# Altium project Common_ASIC_tester.PrjPcb (part 1 of 2)
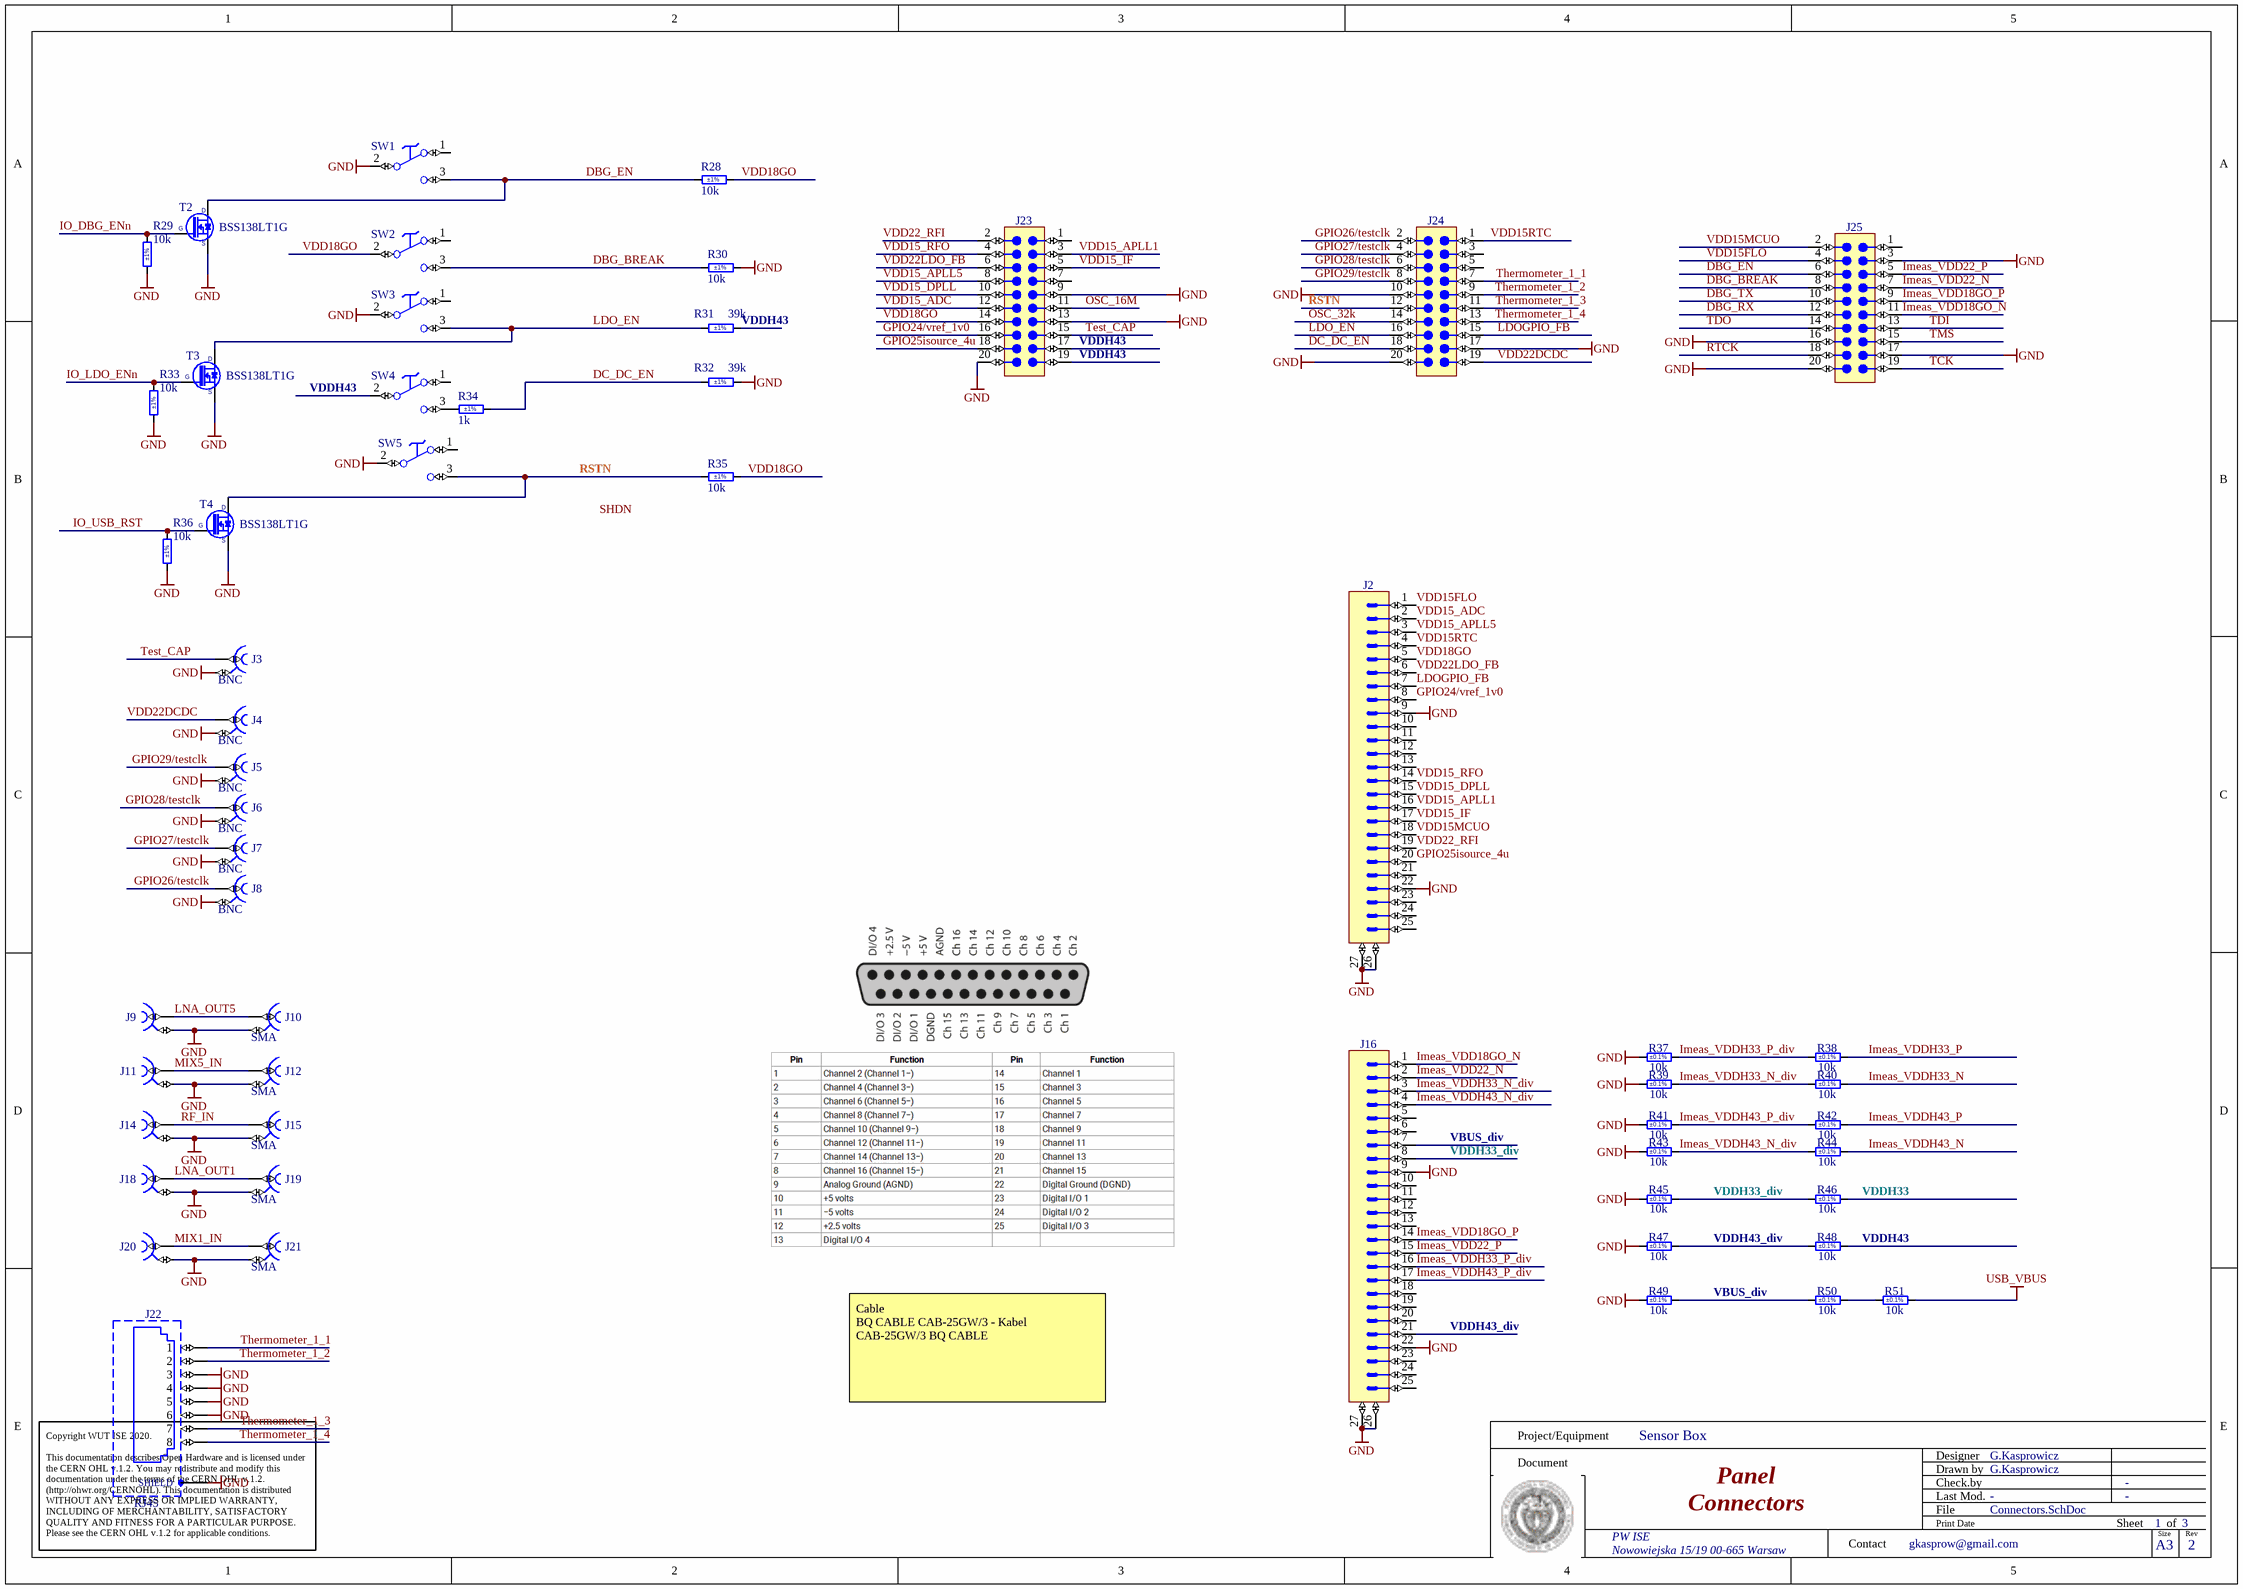
[diagram p0: Connectors.SchDoc]
4 sheets, 175 parts. Net scope: global (net labels, ports and power ports of the same name join across sheets).
Board file: Common_ASIC_tester.PcbDoc
Sheets:
  Connectors.SchDoc
  DIGITAL.SchDoc
  MAIN.SchDoc
  POWER.SchDoc

## Sheet Connectors.SchDoc: Panel
size 420 x 297 mm; Author: G.Kasprowicz; CompanyName: WUT ISE; DrawnBy: G.Kasprowicz; Organization: WUT ISE; Address1: PW ISE; Address2: Nowowiejska 15/19 00-665 Warsaw; Address3: gkasprow@gmail.com; DocumentNumber: 1; Revision: 2; SheetNumber: 1; SheetTotal: 3; ModifiedBy: -; CheckedDate: -; Title2: Connectors; DivGrp: WUT ISE; Designer: G.Kasprowicz; ModifiedDate: -; ProjectName: Sensor Box

### Parts
J2  D-Sub  [AMPHENOL_L717SDBH25POL2RM8C309]  (value not drawn)
J3  BNC  [TYCO_5-1634506-1]
J4  BNC  [TYCO_5-1634506-1]
J5  BNC  [TYCO_5-1634506-1]
J6  BNC  [TYCO_5-1634506-1]
J7  BNC  [TYCO_5-1634506-1]
J8  BNC  [TYCO_5-1634506-1]
J9  Coax_1Female_1Shield  [SAMTEC_MMCX-J-P-H-ST-TH1]  (value not drawn)
J10  SMA  [SAMTEC_SMA-J-P-H-ST-TH1]
J11  Coax_1Female_1Shield  [SAMTEC_MMCX-J-P-H-ST-TH1]  (value not drawn)
J12  SMA  [SAMTEC_SMA-J-P-H-ST-TH1]
J14  Coax_1Female_1Shield  [SAMTEC_MMCX-J-P-H-ST-TH1]  (value not drawn)
J15  SMA  [SAMTEC_SMA-J-P-H-ST-TH1]
J16  D-Sub  [AMPHENOL_L717SDBH25POL2RM8C309]  (value not drawn)
J18  Coax_1Female_1Shield  [SAMTEC_MMCX-J-P-H-ST-TH1]  (value not drawn)
J19  SMA  [SAMTEC_SMA-J-P-H-ST-TH1]
J20  Coax_1Female_1Shield  [SAMTEC_MMCX-J-P-H-ST-TH1]  (value not drawn)
J21  SMA  [SAMTEC_SMA-J-P-H-ST-TH1]
J22  RJ45  [TYCO_6368150-1]
J23  Header 20  [3M_45220-600230]  (value not drawn)
J24  Header 20  [3M_45220-600230]  (value not drawn)
J25  Header 20  [3M_45220-600230]  (value not drawn)
R28  10k  Tolerance: ±1%  [RESC1005X40N]
R29  10k  Tolerance: ±1%  [RESC1005X40N]
R30  10k  Tolerance: ±1%  [RESC1005X40N]
R31  39k  Tolerance: ±1%  [RESC1005X40N]
R32  39k  Tolerance: ±1%  [RESC1005X40N]
R33  10k  Tolerance: ±1%  [RESC1005X40N]
R34  1k  Tolerance: ±1%  [RESC1005X40N]
R35  10k  Tolerance: ±1%  [RESC1005X40N]
R36  10k  Tolerance: ±1%  [RESC1005X40N]
R37  10k  Tolerance: ±0.1%  [RESC1608X55N]
R38  10k  Tolerance: ±0.1%  [RESC1608X55N]
R39  10k  Tolerance: ±0.1%  [RESC1608X55N]
R40  10k  Tolerance: ±0.1%  [RESC1608X55N]
R41  10k  Tolerance: ±0.1%  [RESC1608X55N]
R42  10k  Tolerance: ±0.1%  [RESC1608X55N]
R43  10k  Tolerance: ±0.1%  [RESC1608X55N]
R44  10k  Tolerance: ±0.1%  [RESC1608X55N]
R45  10k  Tolerance: ±0.1%  [RESC1608X55N]
R46  10k  Tolerance: ±0.1%  [RESC1608X55N]
R47  10k  Tolerance: ±0.1%  [RESC1608X55N]
R48  10k  Tolerance: ±0.1%  [RESC1608X55N]
R49  10k  Tolerance: ±0.1%  [RESC1608X55N]
R50  10k  Tolerance: ±0.1%  [RESC1608X55N]
R51  10k  Tolerance: ±0.1%  [RESC1608X55N]
SW1  Switch  [SW_TYCO_1-1437575-4]  (value not drawn)
SW2  Switch  [SW_TYCO_1-1437575-4]  (value not drawn)
SW3  Switch  [SW_TYCO_1-1437575-4]  (value not drawn)
SW4  Switch  [SW_TYCO_1-1437575-4]  (value not drawn)
SW5  Switch  [SW_TYCO_1-1437575-4]  (value not drawn)
T2  BSS138LT1G  [SOT95P240X110-3N]
T3  BSS138LT1G  [SOT95P240X110-3N]
T4  BSS138LT1G  [SOT95P240X110-3N]

### Nets
GND: J2.9 J2.22 J2.26 J2.27 J3.2 J4.2 J5.2 J6.2 J7.2 J8.2 J9.2 J10.2 J11.2 J12.2 J14.2 J15.2 J16.9 J16.22 J16.26 J16.27 J18.2 J19.2 J20.2 J21.2 J22.3 J22.4 J22.5 J22.6 J22.SHIELD J23.9 J23.13 J23.20 J24.10 J24.17 J24.20 J25.3 J25.16 J25.17 J25.20 R29.2 R30.2 R32.1 R33.2 R36.2 R37.1 R39.1 R41.1 R43.1 R45.1 R47.1 R49.1 SW1.2(C) SW3.2(C) SW5.2(C) T2.2(S) T3.2(S) T4.2(S)
USB_VBUS: R51.2
DBG_BREAK: J25.8 R30.1 SW2.3(NO)
DBG_EN: J25.6 R28.1 SW1.3(NO) T2.3(D)
DBG_RX: J25.12
DBG_TX: J25.10
DC_DC_EN: J24.18 R32.2 R34.1
GPIO24/vref_1v0: J2.8 J23.16
GPIO25isource_4u: J2.20 J23.18
GPIO26/testclk: J8.1 J24.2
GPIO27/testclk: J7.1 J24.4
GPIO28/testclk: J6.1 J24.6
GPIO29/testclk: J5.1 J24.8
Imeas_VDD18GO_N: J16.1 J25.11
Imeas_VDD18GO_P: J16.14 J25.9
Imeas_VDD22_N: J16.2 J25.7
Imeas_VDD22_P: J16.15 J25.5
Imeas_VDDH33_N: R40.2
Imeas_VDDH33_N_div: J16.3 R39.2 R40.1
Imeas_VDDH33_P: R38.2
Imeas_VDDH33_P_div: J16.16 R37.2 R38.1
Imeas_VDDH43_N: R44.2
Imeas_VDDH43_N_div: J16.4 R43.2 R44.1
Imeas_VDDH43_P: R42.2
Imeas_VDDH43_P_div: J16.17 R41.2 R42.1
IO_DBG_ENn: R29.1 T2.1(G)
IO_LDO_ENn: R33.1 T3.1(G)
IO_USB_RST: R36.1 T4.1(G)
LDO_EN: J24.16 R31.2 SW3.3(NO) T3.3(D)
LDOGPIO_FB: J2.7 J24.15
LNA_OUT1: J18.1 J19.1
LNA_OUT5: J9.1 J10.1
MIX1_IN: J20.1 J21.1
MIX5_IN: J11.1 J12.1
OSC_16M: J23.11
OSC_32k: J24.14
RF_IN: J14.1 J15.1
RSTN: J24.12 R35.1 SW5.3(NO) T4.3(D)
RTCK: J25.18
TCK: J25.19
TDI: J25.13
TDO: J25.14
Test_CAP: J3.1 J23.15
Thermometer_1_1: J22.1 J24.7
Thermometer_1_2: J22.2 J24.9
Thermometer_1_3: J22.7 J24.11
Thermometer_1_4: J22.8 J24.13
TMS: J25.15
VBUS_div: J16.7 R49.2 R50.1
VDD15_ADC: J2.2 J23.12
VDD15_APLL1: J2.16 J23.3
VDD15_APLL5: J2.3 J23.8
VDD15_DPLL: J2.15 J23.10
VDD15_IF: J2.17 J23.5
VDD15_RFO: J2.14 J23.4
VDD15FLO: J2.1 J25.4
VDD15MCUO: J2.18 J25.2
VDD15RTC: J2.4 J24.1
VDD18GO: J2.5 J23.14 R28.2 R35.2 SW2.2(C)
VDD22_RFI: J2.19 J23.2
VDD22DCDC: J4.1 J24.19
VDD22LDO_FB: J2.6 J23.6
VDDH33: R46.2
VDDH33_div: J16.8 R45.2 R46.1
VDDH43: J23.17 J23.19 R31.1 R48.2 SW4.2(C)
VDDH43_div: J16.21 R47.2 R48.1
NetR34_2: R34.2 SW4.3(NO)
NetR50_2: R50.2 R51.1

Not connected (* = marked no-connect by the designer): J2 10 11 12 13 21 23 24 25; J16 5 6 10 11 12 13 18 19 20 23 24 25; J23 1 7; J24 3 5; J25 1; SW1 1(NC); SW2 1(NC); SW3 1(NC); SW4 1(NC); SW5 1(NC)

### Notes on the sheet
- Cable
  BQ CABLE CAB-25GW/3 - Kabel
  CAB-25GW/3 BQ CABLE
- Labels drawn without touching a wire or pin: SHDN
- Project/Equipment
- Document
- Designer
- Drawn by
- Check.by
- Copyright WUT ISE 2020.
  This documentation describes Open Hardware and is licensed under the CERN OHL v.1.2. You may redistribute and modify this documentation under the terms of the CERN OHL v.1.2. (http://ohwr.org/CERNOHL). This documentation is distributed WITHOUT ANY EXPRESS OR IMPLIED WARRANTY, INCLUDING OF MERCHANTABILITY, SATISFACTORY QUALITY AND FITNESS FOR A PARTICULAR PURPOSE. Please see the CERN OHL v.1.2 for applicable conditions.
- Contact
- File
- Last Mod.
- Print Date
- Sheet
- Size
- A3
- of
- Rev

### Library data of the parts
J2 J16 = AMPHENOL_L717SDBH25POL2RM8C309: Connector D-sub 25 Male; Part Description: Straight D-Sub 25 Male Contacts with Rear Insert 4-40 and Retention Clip + Front Screwlock (UNC4-40); PressFit: No; Part Number: AMPHENOL_L717SDBH25POL2RM8C309; Component Kind: Standard; Component Type: Standard; Pin Count: 27; Family: D-Sub; Mounted: Yes; Socket: No; SMD: No; Sense: No; Status: None; Manufacturer: AMPHENOL; Manufacturer Part Number: L717SDBH25POL2RM8C309; ComponentHeight: 12.9mm; HelpURL: \\cern.ch\dfs\Applications\Altium\Datasheets\AMPHENOL_L717SDBH25POL2RM8C309.pdf; Author: CERN DEM BC; CreateDate: 18.05.2021; LatestRevisionDate: 18.05.2021
J3-J8 = TYCO_5-1634506-1: Part Description: 50 Ohms BNC PCB Straight Socket; Manufacturer: TYCO ELECTRONICS; PressFit: No; Part Number: TYCO_5-1634506-1; Component Kind: Standard; Component Type: Standard; Pin Count: 2; Family: BNC; Mounted: Yes; Socket: No; SMD: No; Sense: No; Status: None; Manufacturer Part Number: 5-1634506-1; ComponentHeight: 16.7mm; HelpURL: \\cern.ch\dfs\Applications\Altium\Datasheets\TYCO_5-1634506-1.pdf; Author: CERN DEM JLC; CreateDate: 14.02.2011; LatestRevisionDate: 14.02.2011
J9 J11 J14 J18 J20 = SAMTEC_MMCX-J-P-H-ST-TH1: Part Description: Straight Through-hole 50 Ohm Micro Mini RF Jack, MMCX Series; Manufacturer: SAMTEC; PressFit: No; Part Number: SAMTEC_MMCX-J-P-H-ST-TH1; Component Kind: Standard; Component Type: Standard; Pin Count: 2; Mounted: Yes; Socket: No; SMD: No; Sense: No; Status: None; Manufacturer Part Number: MMCX-J-P-H-ST-TH1; ComponentHeight: 4.35mm; HelpURL: \\cern.ch\dfs\Applications\Altium\Datasheets\SAMTEC_MMCX-J-P-H-ST-TH1.pdf; Author: CERN DEM JLC; CreateDate: 05.12.2012; LatestRevisionDate: 05.12.2012
J10 J12 J15 J19 J21 = SAMTEC_SMA-J-P-H-ST-TH1: Part Description: 50 Ohm SMA Straight Through-hole PCB Jack; Manufacturer: SAMTEC; PressFit: No; Part Number: SAMTEC_SMA-J-P-H-ST-TH1; Component Kind: Standard; Component Type: Standard; Pin Count: 5; Family: SMA; Mounted: Yes; Socket: No; SMD: No; Sense: No; Status: None; Manufacturer Part Number: SMA-J-P-H-ST-TH1; ComponentHeight: 9.55mm; HelpURL: \\cern.ch\dfs\Applications\Altium\Datasheets\SAMTEC_SMA-J-P-H-ST-TH1.pdf; Author: CERN DEM BC; CreateDate: 11.01.2021; LatestRevisionDate: 11.01.2021
J22 = TYCO_6368150-1: Connector RJ45 + Shield; Part Description: 1 Port, RJ45 Connector,  8 Positions, Shielded, Straight, Category 5; Manufacturer: TYCO ELECTRONICS; PressFit: No; Part Number: TYCO_6368150-1; Component Kind: Standard; Component Type: Standard; Pin Count: 10; Family: RJ45; Mounted: Yes; Socket: No; SMD: No; Sense: No; Status: None; Manufacturer Part Number: 6368150-1; ComponentHeight: 17.02mm; HelpURL: \\cern.ch\dfs\Applications\Altium\Datasheets\TYCO_6368150-1.pdf; Author: CERN DEM MR; CreateDate: 18.06.2019; LatestRevisionDate: 18.06.2019
J23-J25 = 3M_45220-600230: Connector 20 Male; Part Description: 20 Contacts - 1.27mm (0.050") Pitch - Shrouded Boardmount Vertical Header Without Latch/Ejectors, 452 Series; Manufacturer: 3M; PressFit: No; Part Number: 3M_45220-600230; Component Kind: Standard; Component Type: Standard; Pin Count: 20; Family: Header 20; Mounted: Yes; Socket: No; SMD: No; Sense: No; Status: None; Manufacturer Part Number: 45220-600230; ComponentHeight: 5.64mm; HelpURL: \\cern.ch\dfs\Applications\Altium\Datasheets\3M_45220-600230.pdf; Author: CERN DEM MR; CreateDate: 15.08.2019; LatestRevisionDate: 15.08.2019
R28-R30 R33 R35 R36 = R0402_10K_1%_0.0625W_100PPM: Resistor - 1%; Part Description: General Purpose Thick Film Chip Resistor; Manufacturer: GENERIC; Manufacturer1 Part Number: 232270671003L; TC: ±100ppm/°C; PressFit: No; Value: 10k; Part Number: R0402_10K_1%_0.0625W_100PPM; Component Kind: Standard; Component Type: Standard; Pin Count: 2; Status: Not Recommended; Power: 0.0625W; Manufacturer Part Number: R0402_10K_1%_0.0625W_100PPM; Case: 0402; Mounted: Yes; Sense: No; Socket: No; SMD: Yes; Manufacturer1 Example: YAGEO PHYCOMP; Manufacturer1 ComponentHeight: 0.4mm; HelpURL: \\cern.ch\dfs\Applications\Altium\Datasheets\R0402_Phycomp_RC0402.pdf; Author: CERN DEM JLC; CreateDate: 03.12.2007; LatestRevisionDate: 17.10.2012
R31 R32 = R0402_39K_1%_0.0625W_100PPM: Resistor - 1%; Part Description: General Purpose Thick Film Chip Resistor; Manufacturer: GENERIC; Manufacturer1 Part Number: 232270673903; TC: ±100ppm/°C; PressFit: No; Value: 39k; Part Number: R0402_39K_1%_0.0625W_100PPM; Component Kind: Standard; Component Type: Standard; Pin Count: 2; Status: Not Recommended; Power: 0.0625W; Manufacturer Part Number: R0402_39K_1%_0.0625W_100PPM; Case: 0402; Mounted: Yes; Sense: No; Socket: No; SMD: Yes; Manufacturer1 Example: YAGEO PHYCOMP; Manufacturer1 ComponentHeight: 0.4mm; HelpURL: \\cern.ch\dfs\Applications\Altium\Datasheets\R0402_Phycomp_RC0402.pdf; Author: CERN DEM JLC; CreateDate: 03.12.2007; LatestRevisionDate: 17.10.2012
R34 = R0402_1K_1%_0.0625W_100PPM: Resistor - 1%; Part Description: General Purpose Thick Film Chip Resistor; Manufacturer: GENERIC; Manufacturer1 Part Number: 232270671002L; TC: ±100ppm/°C; PressFit: No; Value: 1k; Part Number: R0402_1K_1%_0.0625W_100PPM; Component Kind: Standard; Component Type: Standard; Pin Count: 2; Status: Not Recommended; Power: 0.0625W; Manufacturer Part Number: R0402_1K_1%_0.0625W_100PPM; Case: 0402; Mounted: Yes; Sense: No; Socket: No; SMD: Yes; Manufacturer1 Example: YAGEO PHYCOMP; Manufacturer1 ComponentHeight: 0.4mm; HelpURL: \\cern.ch\dfs\Applications\Altium\Datasheets\R0402_Phycomp_RC0402.pdf; Author: CERN DEM JLC; CreateDate: 03.12.2007; LatestRevisionDate: 17.10.2012
R37-R51 = R0603_10K_0.1%_0.063W_10PPM: Resistor - 0.1%; Part Description: Thin Film Chip Resistor; Manufacturer: GENERIC; Manufacturer1 Part Number: RN73C1J10KBTDF; Power: 0.063W; TC: ±10ppm; PressFit: No; Part Number: R0603_10K_0.1%_0.063W_10PPM; Component Kind: Standard; Component Type: Standard; Pin Count: 2; Value: 10k; Status: Not Recommended; Manufacturer Part Number: R0603_10K_0.1%_0.063W_10PPM; Case: 0603; Mounted: Yes; Sense: No; Socket: No; SMD: Yes; Manufacturer1 Example: TYCO HOLSWORTHY; Manufacturer1 ComponentHeight: 0.5mm; HelpURL: \\cern.ch\dfs\Applications\Altium\Datasheets\R0603_Tyco_RN73.pdf; Author: CERN DEM JLC; CreateDate: 03.12.2007; LatestRevisionDate: 13.03.2008
SW1-SW5 = SW_TYCO_1-1437575-4: SPDT Switch; Part Description: 30VDC, 100mA, Slide Low Profile SPDT Switch, SSA Series; Manufacturer: TYCO; Manufacturer Part Number: 1-1437575-4 or SSA-12; PressFit: No; Part Number: SW_TYCO_1-1437575-4; Component Kind: Standard; Component Type: Standard; Pin Count: 3; PackageDescription: Body 8.79 x 3.4mm, Slide Low Profile SPDT Switch, SSA Series; Family: Switch; Mounted: Yes; Socket: No; SMD: No; Sense: No; Status: None; ComponentHeight: 5.4mm; HelpURL: \\cern.ch\dfs\Applications\Altium\Datasheets\SW_TYCO_1-1437575-4.pdf; Author: CERN DEM JLC; CreateDate: 11.11.2013; LatestRevisionDate: 11.11.2013
T2-T4 = BSS138LT1G: N-CHANNEL MOSFET WITH DIODE; Part Description: 50V, 200mA N-Channel Enhancement Mode Field-Effect Transistor; Manufacturer: ON SEMICONDUCTOR; PressFit: No; Bonding: No; Part Number: BSS138LT1G; Component Kind: Standard; Component Type: Standard; Device: BSS138LT1G; PackageDescription: SOT23, 0.95mm Pitch; 3 Pin, 1.40mm W X 3.00mm L X 1.10mm H body, IPC Medium Density; Manufacturer Part Number: BSS138LT1G; Pin Count: 3; Case: SOT23-3; Mounted: Yes; Socket: No; SMD: Yes; Sense: No; ComponentHeight: 1.11mm; HelpURL: \\cern.ch\dfs\Applications\Altium\Datasheets\BSS138LT1G.pdf; Author: CERN DEM JLC; CreateDate: 23.03.2009; LatestRevisionDate: 23.03.2009

## Sheet DIGITAL.SchDoc: Panel
size 420 x 297 mm; Author: G.Kasprowicz; CompanyName: WUT ISE; DrawnBy: G.Kasprowicz; Organization: WUT ISE; Address1: PW ISE; Address2: Nowowiejska 15/19 00-665 Warsaw; Address3: gkasprow@gmail.com; DocumentNumber: 2; Revision: 2; SheetNumber: 2; SheetTotal: 3; ModifiedBy: -; CheckedDate: -; Title2: USB&JTAG; DivGrp: WUT ISE; Designer: G.Kasprowicz; ModifiedDate: -; ProjectName: Sensor Box
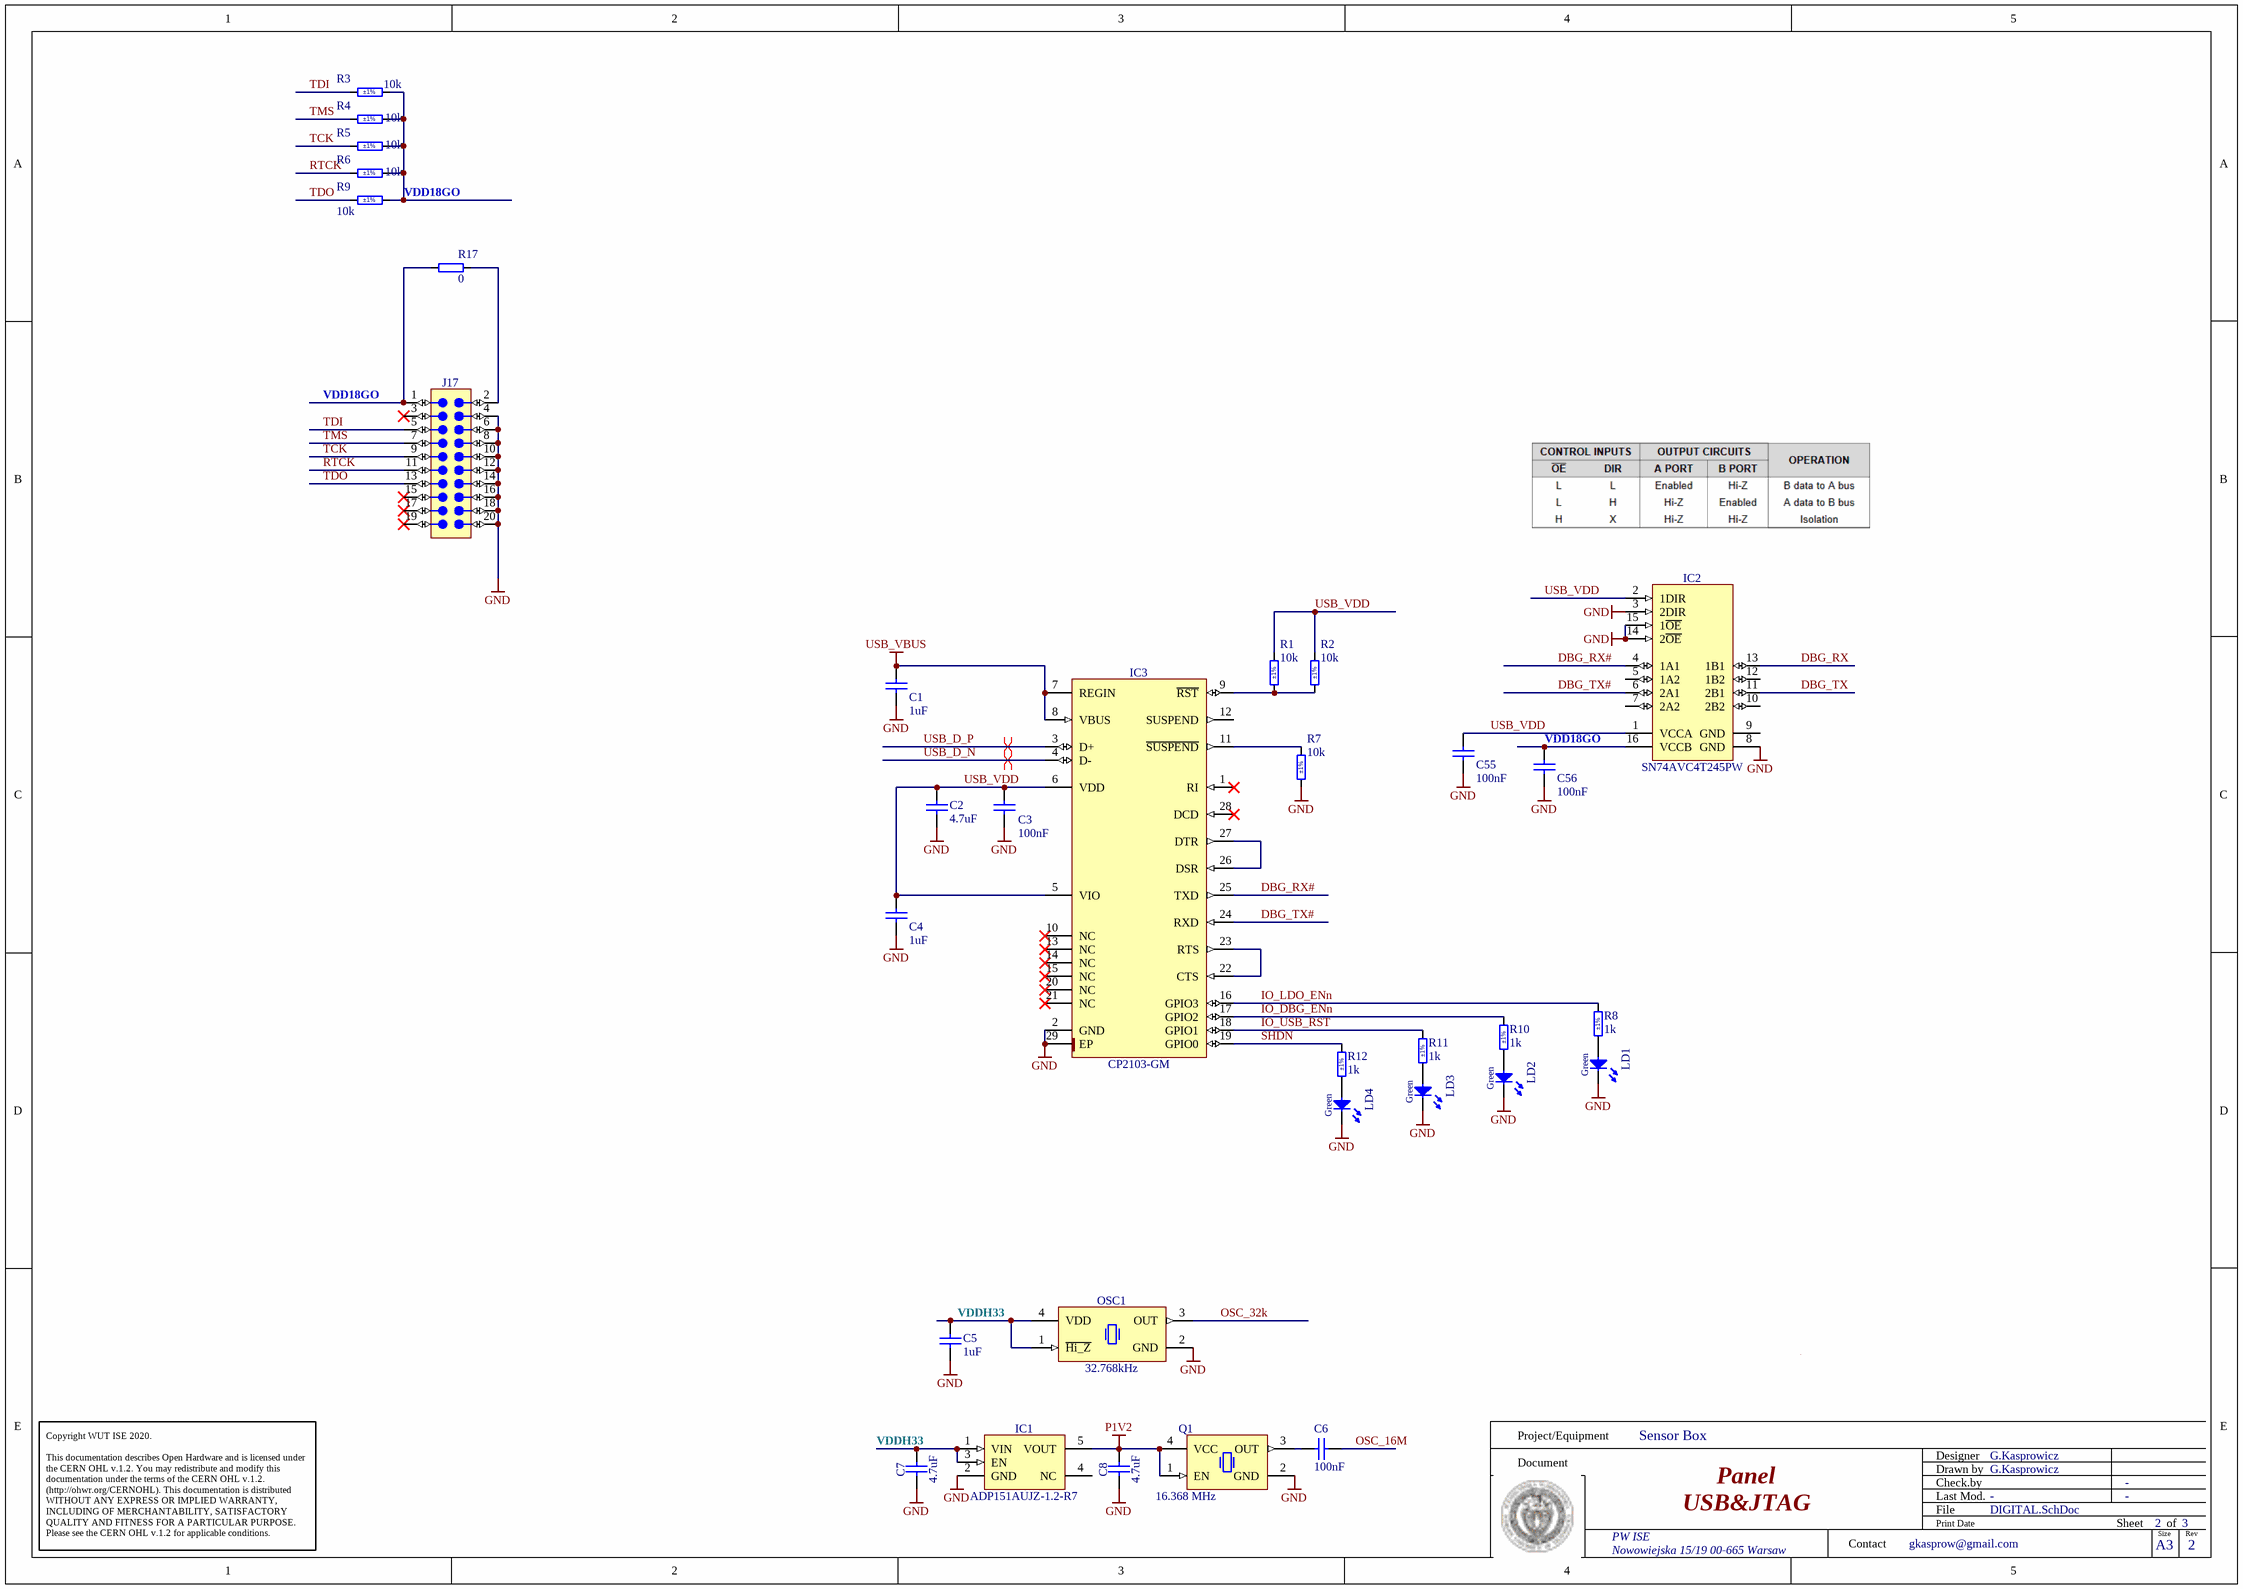
[diagram p1: DIGITAL.SchDoc]

### Parts
C1  1uF  [CAPC1005X55N]
C2  4.7uF  [CAPC1005X55N]
C3  100nF  [CAPC1005X55N]
C4  1uF  [CAPC1005X55N]
C5  1uF  [CAPC1005X55N]
C6  100nF  [CAPC1005X55N]
C7  4.7uF  [CAPC1005X55N]
C8  4.7uF  [CAPC1005X55N]
C55  100nF  [CAPC1005X55N]
C56  100nF  [CAPC1005X55N]
IC1  ADP151AUJZ-1.2-R7  [SOT95P280X90-5N]
IC2  SN74AVC4T245PW  [SOP65P640X120-16N]
IC3  CP2103-GM  [QFN50P500X500X100-29N-S335]
J17  Header 20  [SAMTEC_MTLW-110-07-L-D-250]  (value not drawn)
LD1  Green  [LED_KINGBRIGHT_KP-1608CGCK]
LD2  Green  [LED_KINGBRIGHT_KP-1608CGCK]
LD3  Green  [LED_KINGBRIGHT_KP-1608CGCK]
LD4  Green  [LED_KINGBRIGHT_KP-1608CGCK]
OSC1  32.768kHz  [OSC_ABRACON_ASE]
Q1  16.368 MHz  [XTAL_TXC_8Y]
R1  10k  Tolerance: ±1%  [RESC1005X40N]
R2  10k  Tolerance: ±1%  [RESC1005X40N]
R3  10k  Tolerance: ±1%  [RESC1005X40N]
R4  10k  Tolerance: ±1%  [RESC1005X40N]
R5  10k  Tolerance: ±1%  [RESC1005X40N]
R6  10k  Tolerance: ±1%  [RESC1005X40N]
R7  10k  Tolerance: ±1%  [RESC1005X40N]
R8  1k  Tolerance: ±1%  [RESC1005X40N]
R9  10k  Tolerance: ±1%  [RESC1005X40N]
R10  1k  Tolerance: ±1%  [RESC1005X40N]
R11  1k  Tolerance: ±1%  [RESC1005X40N]
R12  1k  Tolerance: ±1%  [RESC1005X40N]
R17  0  [RESC1005X40N]

### Nets
GND: C1.1 C2.2 C3.1 C4.1 C5.2 C7.1 C8.1 C55.1 C56.1 IC1.2(GND) IC2.3(2DIR) IC2.8(GND) IC2.14(2~{OE}) IC2.15(1~{OE}) IC3.2(GND) IC3.29(EP) J17.4 J17.6 J17.8 J17.10 J17.12 J17.14 J17.16 J17.18 J17.20 LD1.1(C) LD2.1(C) LD3.1(C) LD4.1(C) OSC1.2(GND) Q1.2(GND) R7.2
P1V2: C8.2 IC1.5(VOUT) Q1.1(EN) Q1.4(VCC)
USB_VBUS: C1.2 IC3.7(REGIN) IC3.8(VBUS)
DBG_RX: IC2.13(1B1)
DBG_RX#: IC2.4(1A1) IC3.25(TXD)
DBG_TX: IC2.11(2B1)
DBG_TX#: IC2.6(2A1) IC3.24(RXD)
IO_DBG_ENn: IC3.17(GPIO2) R10.2
IO_LDO_ENn: IC3.16(GPIO3) R8.2
IO_USB_RST: IC3.18(GPIO1) R11.2
OSC_16M: C6.2
OSC_32k: OSC1.3(OUT)
RTCK: J17.11 R6.1
SHDN: IC3.19(GPIO0) R12.2
TCK: J17.9 R5.1
TDI: J17.5 R3.1
TDO: J17.13 R9.1
TMS: J17.7 R4.1
USB_D_N: IC3.4(D-)
USB_D_P: IC3.3(D+)
USB_VDD: C2.1 C3.2 C4.2 C55.2 IC2.1(VCCA) IC2.2(1DIR) IC3.5(VIO) IC3.6(VDD) R1.1 R2.1
VDD18GO: C56.2 IC2.16(VCCB) J17.1 R3.2 R4.2 R5.2 R6.2 R9.2 R17.2
VDDH33: C5.1 C7.2 IC1.1(VIN) IC1.3(EN) OSC1.1(~{Hi_Z}) OSC1.4(VDD)
NetC6_1: C6.1 Q1.3(OUT)
NetIC3_9: IC3.9(~{RST}) R1.2 R2.2
NetIC3_11: IC3.11(~{SUSPEND}) R7.1
NetIC3_22: IC3.22(CTS) IC3.23(RTS)
NetIC3_26: IC3.26(DSR) IC3.27(DTR)
NetJ17_2: J17.2 R17.1
NetLD1_2: LD1.2(A) R8.1
NetLD2_2: LD2.2(A) R10.1
NetLD3_2: LD3.2(A) R11.1
NetLD4_2: LD4.2(A) R12.1

Not connected (* = marked no-connect by the designer): IC1 4(NC); IC2 5(1A2) 7(2A2) 9(GND) 10(2B2) 12(1B2); IC3 1(RI)* 10(NC)* 12(SUSPEND) 13(NC)* 14(NC)* 15(NC)* 20(NC)* 21(NC)* 28(DCD)*; J17 3* 15* 17* 19*

### Layout directives
differential pair: USB_D_N, USB_D_P

### Notes on the sheet
- Project/Equipment
- Document
- Designer
- Drawn by
- Check.by
- Copyright WUT ISE 2020.
  This documentation describes Open Hardware and is licensed under the CERN OHL v.1.2. You may redistribute and modify this documentation under the terms of the CERN OHL v.1.2. (http://ohwr.org/CERNOHL). This documentation is distributed WITHOUT ANY EXPRESS OR IMPLIED WARRANTY, INCLUDING OF MERCHANTABILITY, SATISFACTORY QUALITY AND FITNESS FOR A PARTICULAR PURPOSE. Please see the CERN OHL v.1.2 for applicable conditions.
- Contact
- File
- Last Mod.
- Print Date
- Sheet
- Size
- A3
- of
- Rev

### Library data of the parts
C1 C4 C5 = CC0402_1UF_16V_10%_X5R: Non-polarised capacitor; Part Description: SMD Multilayer Chip Ceramic Capacitor; Manufacturer: GENERIC; Manufacturer1 Part Number: C1005X5R1C105KT; Voltage: 16V; TC: X5R; Tolerance: ±10%; Value: 1uF; Part Number: CC0402_1UF_16V_10%_X5R; Component Kind: Standard; Component Type: Standard; Pin Count: 2; Status: Preferred; Manufacturer Part Number: CC0402_1UF_16V_10%_X5R; Case: 0402; Mounted: Yes; Socket: No; SMD: Yes; Sense: No; Manufacturer1 Example: TDK; Manufacturer1 ComponentHeight: 0.55mm; HelpURL: \\cern.ch\dfs\Applications\Altium\Datasheets\CC0402_X5R_TDK_C.pdf; Author: CERN DEM JLC; CreateDate: 25.10.2012; LatestRevisionDate: 25.10.2012
C2 C7 C8 = CC0402_4.7UF_10V_10%_X5R: Non-polarised capacitor; Part Description: SMD Multilayer Chip Ceramic Capacitor; Manufacturer: GENERIC; Manufacturer1 Part Number: C1005X5R1A475K050; Voltage: 10V; TC: X5R; Tolerance: ±10%; Value: 4.7uF; Part Number: CC0402_4.7UF_10V_10%_X5R; Component Kind: Standard; Component Type: Standard; Pin Count: 2; Status: Preferred; Manufacturer Part Number: CC0402_4.7UF_10V_10%_X5R; Case: 0402; Mounted: Yes; Socket: No; SMD: Yes; Sense: No; Manufacturer1 Example: TDK; Manufacturer1 ComponentHeight: 0.65mm; HelpURL: \\cern.ch\dfs\Applications\Altium\Datasheets\CC0402_X5R_TDK_C.pdf; Author: CERN DEM BC; CreateDate: 10.01.2020; LatestRevisionDate: 10.01.2020
C3 C6 C55 C56 = CC0402_100NF_16V_10%_X5R: Non-polarised capacitor; Part Description: SMD Multilayer Chip Ceramic Capacitor; Manufacturer: GENERIC; Manufacturer1 Part Number: GRM155R61C104KA88D; Voltage: 16V; TC: X5R; Tolerance: ±10%; Value: 100nF; Part Number: CC0402_100NF_16V_10%_X5R; Component Kind: Standard; Component Type: Standard; Pin Count: 2; Status: None; Manufacturer Part Number: CC0402_100NF_16V_10%_X5R; Case: 0402; Mounted: Yes; Socket: No; SMD: Yes; Sense: No; Manufacturer1 Example: MURATA; Manufacturer1 ComponentHeight: 0.55mm; HelpURL: \\cern.ch\dfs\Applications\Altium\Datasheets\CC0402_X5R_MURATA_GRM.pdf; Author: CERN DEM JLC; CreateDate: 10.12.2013; LatestRevisionDate: 10.12.2013
IC1 = ADP151AUJZ-1.2-R7: Ultralow Noise, 200 mA CMOS Linear Regulator; Part Description: 1.2V, 200mA, Ultralow Noise, CMOS Linear Regulator; Manufacturer: ANALOG DEVICES; PressFit: No; Bonding: No; Part Number: ADP151AUJZ-1.2-R7; Component Kind: Standard; Component Type: Standard; Device: ADP151AUJZ-1.2-R7; PackageDescription: SOT23, 0.95mm pitch; 5 pin, 1.75mm W X 3.00mm L, IPC Medium Density; Manufacturer Part Number: ADP151AUJZ-1.2-R7; Pin Count: 5; Case: SOT23; Mounted: Yes; Socket: No; SMD: Yes; Sense: No; ComponentHeight: 0.9mm; HelpURL: \\cern.ch\dfs\Applications\Altium\Datasheets\ADP151AUJZ-1.2-R7.pdf; Author: CERN DEM JLC; CreateDate: 21.11.2011; LatestRevisionDate: 19.06.2014
IC2 = SN74AVC4T245PW: 4-Bit Dual-Supply Bus Transceiver with Configurable Voltage Translation and 3-State Output; Part Description: 4-Bit Dual-Supply Bus Transceiver With Configurable Voltage Translation and 3-State Outputs; Manufacturer: TEXAS INSTRUMENTS; PressFit: No; Bonding: No; Part Number: SN74AVC4T245PW; Component Kind: Standard; Component Type: Standard; Device: SN74AVC4T245PW; PackageDescription: SOP, 0.65mm Pitch; 16 Pin, 4.40mm W X 5.00mm L X 1.20mm H body, IPC Medium Density; Manufacturer Part Number: SN74AVC4T245PW; Pin Count: 16; Case: TSSOP16; Mounted: Yes; Socket: No; SMD: Yes; Sense: No; ComponentHeight: 1.2mm; Author: CERN DEM JLC; HelpURL: \\cern.ch\dfs\Applications\Altium\Datasheets\SN74AVC4T245PW.pdf; CreateDate: 13.10.2011; LatestRevisionDate: 13.10.2011
IC3 = CP2103-GM: Single-Chip USB to UART Bridge; Manufacturer: SILICON LABS; PressFit: No; Bonding: No; Part Number: CP2103-GM; Component Kind: Standard; Component Type: Standard; Device: CP2103-GM; PackageDescription: QFN, 0.50mm Pitch, Square; 28 Pin, 5.00mm L X 5.00mm W X 1.00mm H body (w/Thermal Tab 3.35 X 3.35mm), IPC Medium Density; Part Description: Single-Chip USB to UART Bridge; Manufacturer Part Number: CP2103-GM; Pin Count: 29; Case: QFN28; Mounted: Yes; Socket: No; SMD: Yes; Sense: No; ComponentHeight: 1.0mm; Author: CERN DEM JLC; HelpURL: \\cern.ch\dfs\Applications\Altium\Datasheets\CP2103-GM.pdf; CreateDate: 17.08.2011; LatestRevisionDate: 17.08.2011
J17 = SAMTEC_MTLW-110-07-L-D-250: Connector 20 Male; Part Description: 20 Contacts, Pitch 2.54mm, Dual Row Through Mount Straight Header (Post Lead = 6.35mm, Tail Lead 3.05mm, Insulator 1.52mm); Manufacturer: SAMTEC; PressFit: No; Part Number: SAMTEC_MTLW-110-07-L-D-250; Component Kind: Standard; Component Type: Standard; Pin Count: 20; Family: Header 20; Mounted: Yes; Socket: No; SMD: No; Sense: No; Status: None; Manufacturer Part Number: MTLW-110-07-L-D-250; ComponentHeight: 7.87mm; HelpURL: \\cern.ch\dfs\Applications\Altium\Datasheets\SAMTEC_MTLW-110-07-L-D-250.pdf; Author: CERN DEM JLC; CreateDate: 22.01.2013; LatestRevisionDate: 22.01.2013
LD1-LD4 = LED_KINGBRIGHT_KP-1608CGCK: LED Green 1C 2A; Part Description: 1.6x0.8mm SMD Chip Green LED Lamp; PressFit: No; Bonding: No; Part Number: LED_KINGBRIGHT_KP-1608CGCK; Component Kind: Standard; Component Type: Standard; Color: Green; PackageDescription: SMT Green LED, Case 0603, Body L 1.60mm x W 0.80mm x H 1.10mm; Manufacturer: KINGBRIGHT; Manufacturer Part Number: KP-1608CGCK; Pin Count: 2; Case: 0603; Mounted: Yes; Socket: No; SMD: Yes; Sense: No; ComponentHeight: 1.1mm; HelpURL: \\cern.ch\dfs\Applications\Altium\Datasheets\LED_KINGBRIGHT_KP-1608CGCK.pdf; Author: CERN DEM HF; CreateDate: 01.10.2021; LatestRevisionDate: 01.10.2021
OSC1 = OSC_32.768kHz_ABRACON_ASEK-32.768KHz-LRT: Oscillator 32.768KHZ 25PPM 3.3V 3.2 x 2.5 x 1.2mm; PressFit: No; Bonding: No; Part Number: OSC_32.768kHz_ABRACON_ASEK-32.768KHz-LRT; Component Kind: Standard; Component Type: Standard; PackageDescription: SMD Oscillator, Body 3.20mm L X 2.50mm W X 1.20mm H, ASE Serie; Value: 32.768kHz; Part Description: Oscillator 32.768KHZ 25PPM 3.3V 3.2 x 2.5 x 1.2mm; Manufacturer: ABRACON; Manufacturer Part Number: ASEK-32.768KHz-LRT; Pin Count: 4; Mounted: Yes; Socket: No; SMD: Yes; Sense: No; ComponentHeight: 1.2mm; HelpURL: \\cern.ch\dfs\Applications\Altium\Datasheets\XTAL_ABRACON_ASE.pdf; Author: GK; CreateDate: 11.01.2022; LatestRevisionDate: 11.01.2022
Q1 = OSC_16.368 MHz _IQD_LFTCXO077226Cutt: 2.0 x 1.6mm SMD TCXO 16.368 MHz 0.5ppm 1.2V; Manufacturer: IQD; PressFit: No; Bonding: No; Part Number: OSC_16.368 MHz _IQD_LFTCXO077226Cutt; Component Kind: Standard; Component Type: Standard; PackageDescription: 4 Pins, 2x1.6X0.5mm, SMD Crystal oscillator; Value: 16.368 MHz; Part Description: 2.0 x 1.6mm SMD TCXO 16.368 MHz 0.5ppm 1.2V; Manufacturer Part Number: LFTCXO077226Cutt; Pin Count: 4; Mounted: Yes; Socket: No; SMD: Yes; Sense: No; ComponentHeight: 13.6mm; HelpURL: \\cern.ch\dfs\Applications\Altium\Datasheets\XTAL_TXC_8Y.pdf; Author: GK; CreateDate: 08.03.2012; LatestRevisionDate: 08.03.2012
R1-R7 R9 = R0402_10K_1%_0.0625W_100PPM: as R28 on sheet Connectors; Value: 10k; Part Number: R0402_10K_1%_0.0625W_100PPM; Component Kind: Standard; Component Type: Standard; Pin Count: 2; Status: Not Recommended; Power: 0.0625W; Manufacturer Part Number: R0402_10K_1%_0.0625W_100PPM; Case: 0402; Mounted: Yes; Sense: No; Socket: No; SMD: Yes; Manufacturer1 Example: YAGEO PHYCOMP; Manufacturer1 ComponentHeight: 0.4mm; HelpURL: \\cern.ch\dfs\Applications\Altium\Datasheets\R0402_Phycomp_RC0402.pdf; Author: CERN DEM JLC; CreateDate: 03.12.2007; LatestRevisionDate: 17.10.2012
R8 R10-R12 = R0402_1K_1%_0.0625W_100PPM: as R34 on sheet Connectors; Value: 1k; Part Number: R0402_1K_1%_0.0625W_100PPM; Component Kind: Standard; Component Type: Standard; Pin Count: 2; Status: Not Recommended; Power: 0.0625W; Manufacturer Part Number: R0402_1K_1%_0.0625W_100PPM; Case: 0402; Mounted: Yes; Sense: No; Socket: No; SMD: Yes; Manufacturer1 Example: YAGEO PHYCOMP; Manufacturer1 ComponentHeight: 0.4mm; HelpURL: \\cern.ch\dfs\Applications\Altium\Datasheets\R0402_Phycomp_RC0402.pdf; Author: CERN DEM JLC; CreateDate: 03.12.2007; LatestRevisionDate: 17.10.2012
R17 = R0402_0R_JUMPER: Resistor; Part Description: 1A (0.05R Max DC Resistance) Zero Ohm Jumper; Manufacturer: GENERIC; Manufacturer1 Part Number: 232270591001L; PressFit: No; Value: 0; Part Number: R0402_0R_JUMPER; Component Kind: Standard; Component Type: Standard; Pin Count: 2; Status: Not Recommended; Manufacturer Part Number: R0402_0R_JUMPER; Case: 0402; Mounted: Yes; Sense: No; Socket: No; SMD: Yes; Manufacturer1 Example: YAGEO PHYCOMP; Manufacturer1 ComponentHeight: 0.4mm; HelpURL: \\cern.ch\dfs\Applications\Altium\Datasheets\R0402_Phycomp_RC0402.pdf; Author: CERN DEM JLC; CreateDate: 03.12.2007; LatestRevisionDate: 17.10.2012

## Sheet MAIN.SchDoc: ASIC
size 420 x 297 mm; Author: G.Kasprowicz; CompanyName: WUT ISE; DrawnBy: G.Kasprowicz; Organization: WUT ISE; Address1: PW ISE; Address2: Nowowiejska 15/19 00-665 Warsaw; Address3: gkasprow@gmail.com; Revision: 2; SheetNumber: -; SheetTotal: -; ModifiedBy: -; CheckedDate: -; Title2: Test fixture; DivGrp: WUT ISE; Designer: G.Kasprowicz; ModifiedDate: -; ProjectName: Sensor Box
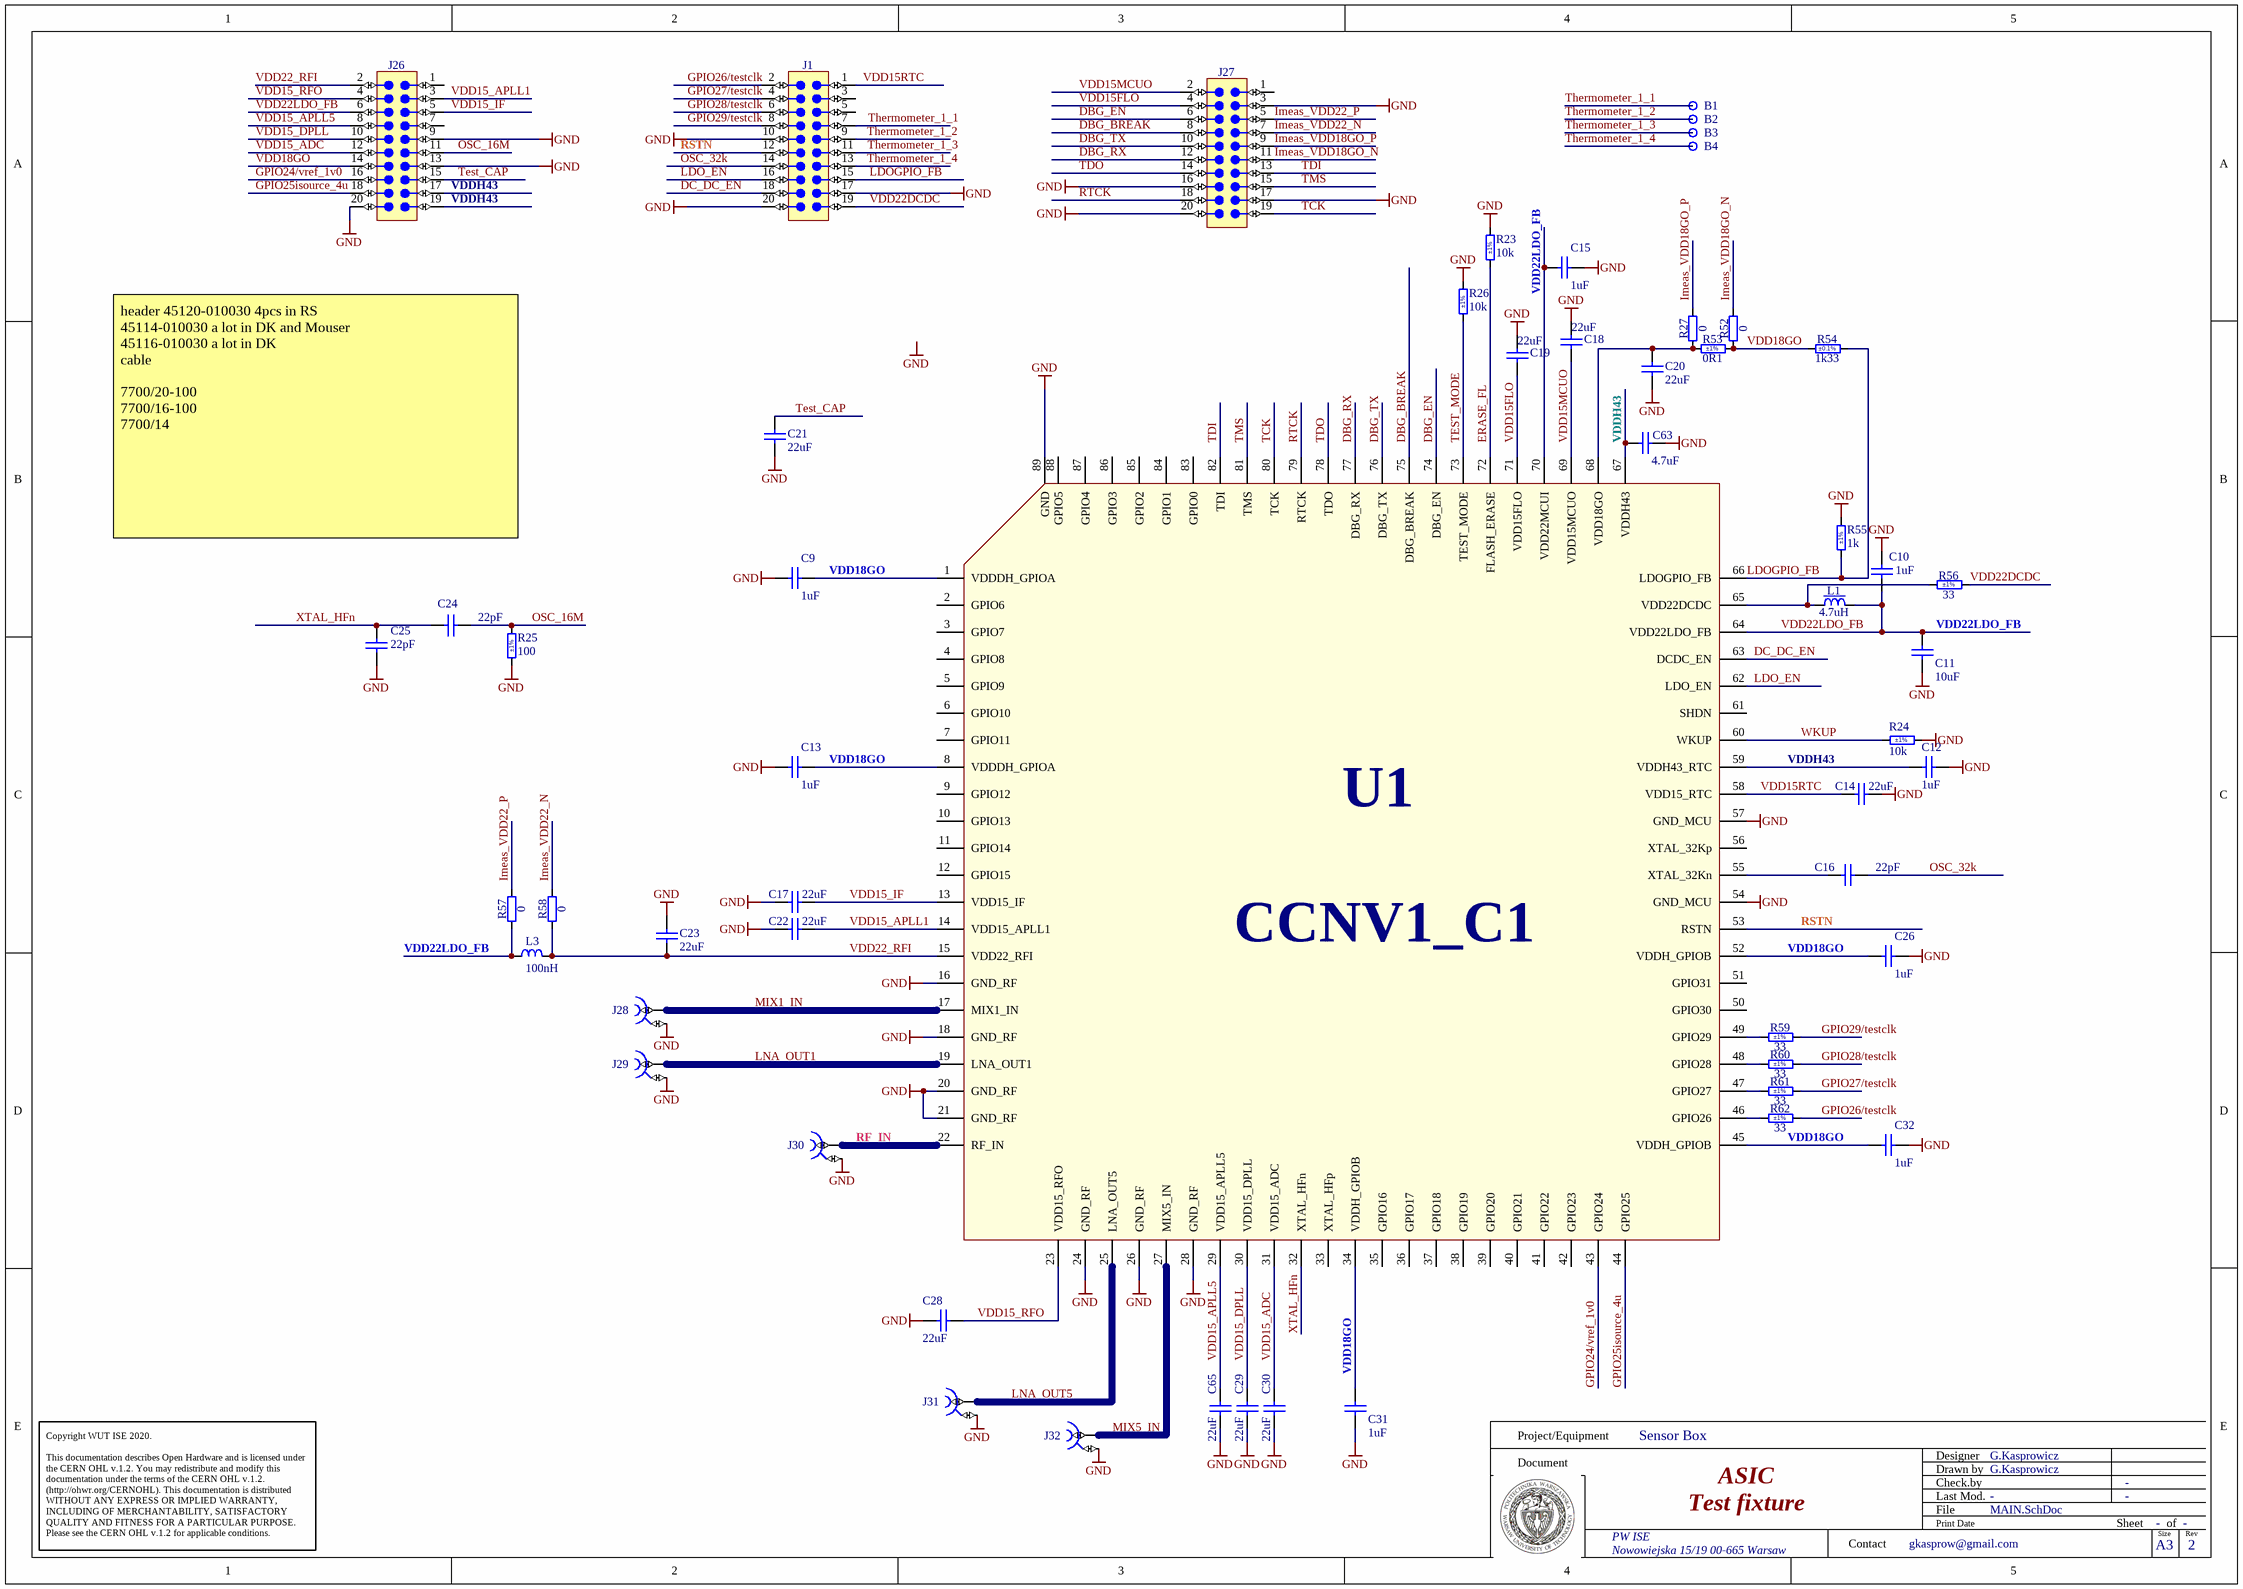
[diagram p2: MAIN.SchDoc]

### Parts
B1  Plated Hole  [c100h50]  (value not drawn)  (no BOM)
B2  Plated Hole  [c100h50]  (value not drawn)  (no BOM)
B3  Plated Hole  [c100h50]  (value not drawn)  (no BOM)
B4  Plated Hole  [c100h50]  (value not drawn)  (no BOM)
C9  1uF  [CAPC1005X55N]
C10  1uF  [CAPC1005X55N]
C11  10uF  [CAPC1608X80N]
C12  1uF  [CAPC1005X55N]
C13  1uF  [CAPC1005X55N]
C14  22uF  [CAPC1608X90N]
C15  1uF  [CAPC1005X55N]
C16  22pF  [CAPC1005X55N]
C17  22uF  [CAPC1608X90N]
C18  22uF  [CAPC1608X90N]
C19  22uF  [CAPC1608X90N]
C20  22uF  [CAPC1608X90N]
C21  22uF  [CAPC1608X90N]
C22  22uF  [CAPC1608X90N]
C23  22uF  [CAPC1608X90N]
C24  22pF  [CAPC1005X55N]
C25  22pF  [CAPC1005X55N]
C26  1uF  [CAPC1005X55N]
C28  22uF  [CAPC1608X90N]
C29  22uF  [CAPC1608X90N]
C30  22uF  [CAPC1608X90N]
C31  1uF  [CAPC1005X55N]
C32  1uF  [CAPC1005X55N]
C63  4.7uF  [CAPC1005X55N]
C65  22uF  [CAPC1608X90N]
J1  Header 20  [3M_45220-600230]  (value not drawn)
J26  Header 20  [3M_45220-600230]  (value not drawn)
J27  Header 20  [3M_45220-600230]  (value not drawn)
J28  Coax_1Female_1Shield  [SAMTEC_MMCX-J-P-H-ST-TH1]  (value not drawn)
J29  Coax_1Female_1Shield  [SAMTEC_MMCX-J-P-H-ST-TH1]  (value not drawn)
J30  Coax_1Female_1Shield  [SAMTEC_MMCX-J-P-H-ST-TH1]  (value not drawn)
J31  Coax_1Female_1Shield  [SAMTEC_MMCX-J-P-H-ST-TH1]  (value not drawn)
J32  Coax_1Female_1Shield  [SAMTEC_MMCX-J-P-H-ST-TH1]  (value not drawn)
L1  4.7uH  [INDC2012X145N]
L3  100nH  [INDC1005X55N]
R23  10k  Tolerance: ±1%  [RESC1005X40N]
R24  10k  Tolerance: ±1%  [RESC1005X40N]
R25  100  Tolerance: ±1%  [RESC1005X40N]
R26  10k  Tolerance: ±1%  [RESC1005X40N]
R27  0  [RESC1005X40N]
R52  0  [RESC1005X40N]
R53  0R1  Tolerance: ±1%  [RESC1608X55N]
R54  1k33  Tolerance: ±0.1%  [RESC1608X55N]
R55  1k  Tolerance: ±1%  [RESC1005X40N]
R56  33  Tolerance: ±1%  [RESC1005X40N]
R57  0  [RESC1005X40N]
R58  0  [RESC1005X40N]
R59  33  Tolerance: ±1%  [RESC1005X40N]
R60  33  Tolerance: ±1%  [RESC1005X40N]
R61  33  Tolerance: ±1%  [RESC1005X40N]
R62  33  Tolerance: ±1%  [RESC1005X40N]
U1  CCNV1_C1  [QFN88-0,4(10x10) - podstawka 2]

### Nets
GND: C9.2 C10.2 C11.1 C12.2 C13.2 C14.2 C15.1 C17.1 C18.2 C19.2 C20.1 C21.1 C22.1 C23.2 C25.2 C26.1 C28.1 C29.1 C30.1 C31.1 C32.1 C63.1 C65.1 J1.10 J1.17 J1.20 J26.9 J26.13 J26.20 J27.3 J27.16 J27.17 J27.20 J28.2 J29.2 J30.2 J31.2 J32.2 R23.2 R24.2 R25.1 R26.2 R55.2 U1.16(GND_RF) U1.18(GND_RF) U1.20(GND_RF) U1.21(GND_RF) U1.24(GND_RF) U1.26(GND_RF) U1.28(GND_RF) U1.54(GND_MCU) U1.57(GND_MCU) U1.89(GND)
DBG_BREAK: J27.8 U1.75(DBG_BREAK)
DBG_EN: J27.6 U1.74(DBG_EN)
DBG_RX: J27.12 U1.77(DBG_RX)
DBG_TX: J27.10 U1.76(DBG_TX)
DC_DC_EN: J1.18 U1.63(DCDC_EN)
ERASE_FL: R23.1 U1.72(FLASH_ERASE)
GPIO24/vref_1v0: J26.16 U1.43(GPIO24)
GPIO25isource_4u: J26.18 U1.44(GPIO25)
GPIO26/testclk: J1.2 R62.2
GPIO27/testclk: J1.4 R61.2
GPIO28/testclk: J1.6 R60.2
GPIO29/testclk: J1.8 R59.2
Imeas_VDD18GO_N: J27.11 R52.2
Imeas_VDD18GO_P: J27.9 R27.2
Imeas_VDD22_N: J27.7 R58.2
Imeas_VDD22_P: J27.5 R57.2
LDO_EN: J1.16 U1.62(LDO_EN)
LDOGPIO_FB: J1.15 R54.2 R55.1 U1.66(LDOGPIO_FB)
LNA_OUT1: J29.1 U1.19(LNA_OUT1)
LNA_OUT5: J31.1 U1.25(LNA_OUT5)
MIX1_IN: J28.1 U1.17(MIX1_IN)
MIX5_IN: J32.1 U1.27(MIX5_IN)
OSC_16M: C24.1 J26.11 R25.2
OSC_32k: C16.1 J1.14
RF_IN: J30.1 U1.22(RF_IN)
RSTN: J1.12 U1.53(RSTN)
RTCK: J27.18 U1.79(RTCK)
TCK: J27.19 U1.80(TCK)
TDI: J27.13 U1.82(TDI)
TDO: J27.14 U1.78(TDO)
Test_CAP: C21.2 J26.15
TEST_MODE: R26.1 U1.73(TEST_MODE)
Thermometer_1_1: B1.1 J1.7
Thermometer_1_2: B2.1 J1.9
Thermometer_1_3: B3.1 J1.11
Thermometer_1_4: B4.1 J1.13
TMS: J27.15 U1.81(TMS)
VDD15_ADC: C30.2 J26.12 U1.31(VDD15_ADC)
VDD15_APLL1: C22.2 J26.3 U1.14(VDD15_APLL1)
VDD15_APLL5: C65.2 J26.8 U1.29(VDD15_APLL5)
VDD15_DPLL: C29.2 J26.10 U1.30(VDD15_DPLL)
VDD15_IF: C17.2 J26.5 U1.13(VDD15_IF)
VDD15_RFO: C28.2 J26.4 U1.23(VDD15_RFO)
VDD15FLO: C19.1 J27.4 U1.71(VDD15FLO)
VDD15MCUO: C18.1 J27.2 U1.69(VDD15MCUO)
VDD15RTC: C14.1 J1.1 U1.58(VDD15_RTC)
VDD18GO: C9.1 C13.1 C26.2 C31.2 C32.2 J26.14 R52.1 R53.2 R54.1 U1.1(VDDDH_GPIOA) U1.8(VDDDH_GPIOA) U1.34(VDDH_GPIOB) U1.45(VDDH_GPIOB) U1.52(VDDH_GPIOB)
VDD22_RFI: C23.1 J26.2 L3.2 R58.1 U1.15(VDD22_RFI)
VDD22DCDC: J1.19 R56.2
VDD22LDO_FB: C10.1 C11.2 C15.2 J26.6 L1.2 L3.1 R57.1 U1.64(VDD22LDO_FB) U1.70(VDD22MCUI)
VDDH43: C12.1 C63.2 J26.17 J26.19 U1.59(VDDH43_RTC) U1.67(VDDH43)
WKUP: R24.1 U1.60(WKUP)
XTAL_HFn: C24.2 C25.1 U1.32(XTAL_HFn)
NetC16_2: C16.2 U1.55(XTAL_32Kn)
NetC20_2: C20.2 R27.1 R53.1 U1.68(VDD18GO)
NetL1_1: L1.1 R56.1 U1.65(VDD22DCDC)
NetR59_1: R59.1 U1.49(GPIO29)
NetR60_1: R60.1 U1.48(GPIO28)
NetR61_1: R61.1 U1.47(GPIO27)
NetR62_1: R62.1 U1.46(GPIO26)

Not connected (* = marked no-connect by the designer): J1 3 5; J26 1 7; J27 1; U1 2(GPIO6) 3(GPIO7) 4(GPIO8) 5(GPIO9) 6(GPIO10) 7(GPIO11) 9(GPIO12) 10(GPIO13) 11(GPIO14) 12(GPIO15) 33(XTAL_HFp) 35(GPIO16) 36(GPIO17) 37(GPIO18) 38(GPIO19) 39(GPIO20) 40(GPIO21) 41(GPIO22) 42(GPIO23) 50(GPIO30) 51(GPIO31) 56(XTAL_32Kp) 61(SHDN) 83(GPIO0) 84(GPIO1) 85(GPIO2) 86(GPIO3) 87(GPIO4) 88(GPIO5)

### Notes on the sheet
- header 45120-010030 4pcs in RS
  45114-010030 a lot in DK and Mouser
  45116-010030 a lot in DK
  cable
  7700/20-100
  7700/16-100
  7700/14
- Labels drawn without touching a wire or pin: GND
- Project/Equipment
- Document
- Designer
- Drawn by
- Check.by
- Copyright WUT ISE 2020.
  This documentation describes Open Hardware and is licensed under the CERN OHL v.1.2. You may redistribute and modify this documentation under the terms of the CERN OHL v.1.2. (http://ohwr.org/CERNOHL). This documentation is distributed WITHOUT ANY EXPRESS OR IMPLIED WARRANTY, INCLUDING OF MERCHANTABILITY, SATISFACTORY QUALITY AND FITNESS FOR A PARTICULAR PURPOSE. Please see the CERN OHL v.1.2 for applicable conditions.
- Contact
- File
- Last Mod.
- Print Date
- Sheet
- Size
- A3
- of
- Rev

### Library data of the parts
B1-B4 = PLATED_HOLE0.5_PAD1.0: Single Terminal Socket; Part Description: Plated Through Hole: Hole Dia.=0.5mm Pad Dia.=1.0mm; Mounted: No; Part Number: PLATED_HOLE0.5_PAD1.0; Component Type: Standard (No BOM); Pin Count: 1; Family: Plated Hole; Socket: No; SMD: No; Sense: No; Status: None; ComponentHeight: 0mm; HelpURL: Undefined; Author: CERN DEM JMW; CreateDate: 06.01.2020; LatestRevisionDate: 06.01.2020; PackageDescription: Plated Through Hole: Hole Dia.=0.5mm Pad Dia.=1.0mm
C9 C10 C12 C13 C15 C26 C31 C32 = CC0402_1UF_16V_10%_X5R: as C1 on sheet DIGITAL; Value: 1uF; Part Number: CC0402_1UF_16V_10%_X5R; Component Kind: Standard; Component Type: Standard; Pin Count: 2; Status: Preferred; Manufacturer Part Number: CC0402_1UF_16V_10%_X5R; Case: 0402; Mounted: Yes; Socket: No; SMD: Yes; Sense: No; Manufacturer1 Example: TDK; Manufacturer1 ComponentHeight: 0.55mm; HelpURL: \\cern.ch\dfs\Applications\Altium\Datasheets\CC0402_X5R_TDK_C.pdf; Author: CERN DEM JLC; CreateDate: 25.10.2012; LatestRevisionDate: 25.10.2012
C11 = CC0603_10UF_10V_10%_X5R: Non-polarised capacitor; Part Description: SMD Multilayer Chip Ceramic Capacitor; Manufacturer: GENERIC; Manufacturer1 Part Number: GRM188R61A106KE69D; Voltage: 10V; TC: X5R; Tolerance: ±10%; Value: 10uF; Part Number: CC0603_10UF_10V_10%_X5R; Component Kind: Standard; Component Type: Standard; Pin Count: 2; Status: None; Manufacturer Part Number: CC0603_10UF_10V_10%_X5R; Case: 0603; Mounted: Yes; Socket: No; SMD: Yes; Sense: No; Manufacturer1 Example: MURATA; Manufacturer1 ComponentHeight: 0.8mm; HelpURL: \\cern.ch\dfs\Applications\Altium\Datasheets\CC0603_MURATA_GRM188R61A106KE69D.pdf; Author: CERN DEM JLC; CreateDate: 31.01.2017; LatestRevisionDate: 31.01.2017
C14 C17-C23 C28-C30 C65 = CC0603_22UF_10V_20%_X5R: Non-polarised capacitor; Part Description: SMD Multilayer Chip Ceramic Capacitor; Manufacturer: GENERIC; Manufacturer1 Part Number: C1608X5R1A226M080; Voltage: 10V; TC: X5R; Tolerance: ±20%; Value: 22uF; Part Number: CC0603_22UF_10V_20%_X5R; Component Kind: Standard; Component Type: Standard; Pin Count: 2; Status: None; Manufacturer Part Number: CC0603_22UF_10V_20%_X5R; Case: 0603; Mounted: Yes; Socket: No; SMD: Yes; Sense: No; Manufacturer1 Example: TDK; Manufacturer1 ComponentHeight: 0.9mm; HelpURL: \\cern.ch\dfs\Applications\Altium\Datasheets\CC0603_X5R_TDK_C.pdf; Author: CERN DEM BC; CreateDate: 03.12.2020; LatestRevisionDate: 03.12.2020
C16 C24 C25 = CC0402_22PF_50V_5%_C0G: Non-polarised capacitor; Part Description: SMD Multilayer Chip Ceramic Capacitor; Manufacturer: GENERIC; Manufacturer1 Part Number: C0402C220J5GACTU; Voltage: 50V; TC: C0G/NP0; Tolerance: ±5%; Value: 22pF; Part Number: CC0402_22PF_50V_5%_C0G; Component Kind: Standard; Component Type: Standard; Pin Count: 2; Status: Preferred; Manufacturer Part Number: CC0402_22PF_50V_5%_C0G; Case: 0402; Mounted: Yes; Socket: No; SMD: Yes; Sense: No; Manufacturer1 Example: KEMET; Manufacturer1 ComponentHeight: 0.55mm; HelpURL: \\cern.ch\dfs\Applications\Altium\Datasheets\CC0402_C0G_KEMET_(Commercial Grade).pdf; Author: CERN DEM JLC; CreateDate: 03.12.2007; LatestRevisionDate: 03.12.2007
C63 = CC0402_4.7UF_10V_10%_X5R: as C2 on sheet DIGITAL; Value: 4.7uF; Part Number: CC0402_4.7UF_10V_10%_X5R; Component Kind: Standard; Component Type: Standard; Pin Count: 2; Status: Preferred; Manufacturer Part Number: CC0402_4.7UF_10V_10%_X5R; Case: 0402; Mounted: Yes; Socket: No; SMD: Yes; Sense: No; Manufacturer1 Example: TDK; Manufacturer1 ComponentHeight: 0.65mm; HelpURL: \\cern.ch\dfs\Applications\Altium\Datasheets\CC0402_X5R_TDK_C.pdf; Author: CERN DEM BC; CreateDate: 10.01.2020; LatestRevisionDate: 10.01.2020
J1 J26 J27 = 3M_45220-600230: as J23 on sheet Connectors; Part Number: 3M_45220-600230; Component Kind: Standard; Component Type: Standard; Pin Count: 20; Family: Header 20; Mounted: Yes; Socket: No; SMD: No; Sense: No; Status: None; Manufacturer Part Number: 45220-600230; ComponentHeight: 5.64mm; HelpURL: \\cern.ch\dfs\Applications\Altium\Datasheets\3M_45220-600230.pdf; Author: CERN DEM MR; CreateDate: 15.08.2019; LatestRevisionDate: 15.08.2019
J28-J32 = SAMTEC_MMCX-J-P-H-ST-TH1: as J9 on sheet Connectors; Part Number: SAMTEC_MMCX-J-P-H-ST-TH1; Component Kind: Standard; Component Type: Standard; Pin Count: 2; Mounted: Yes; Socket: No; SMD: No; Sense: No; Status: None; Manufacturer Part Number: MMCX-J-P-H-ST-TH1; ComponentHeight: 4.35mm; HelpURL: \\cern.ch\dfs\Applications\Altium\Datasheets\SAMTEC_MMCX-J-P-H-ST-TH1.pdf; Author: CERN DEM JLC; CreateDate: 05.12.2012; LatestRevisionDate: 05.12.2012
L1 = IND0805_4.7UH_20%_KEMET_L-DWI: Inductor With Core; Part Description: Wire Wound Chip Inductors; Manufacturer: KEMET; Manufacturer Part Number: L0805C4R7MDWIT; Power: 360mA; Resistance: 0.5R; Tolerance: ±20%; Part Number: IND0805_4.7UH_20%_KEMET_L-DWI; Component Kind: Standard; Component Type: Standard; Pin Count: 2; Value: 4.7uH; Case: 0805; Mounted: Yes; Socket: No; SMD: Yes; Sense: No; ComponentHeight: 1.85mm; HelpURL: \\cern.ch\dfs\Applications\Altium\Datasheets\IND0805_KEMET_L-DWI .pdf; Author: CERN DEM JLC; CreateDate: 26.01.2010; LatestRevisionDate: 26.01.2010
L3 = IND0402_100NH_5%_TDK_MLJ1005: Inductor; Part Description: SMD Inductor for Standard Circuits, MLJ Series; Manufacturer: TDK; Manufacturer Part Number: MLJ1005WR10J; Power: 400mA; Resistance: 0.30R; Tolerance: ±5%; Value: 100nH; Part Number: IND0402_100NH_5%_TDK_MLJ1005; Component Kind: Standard; Component Type: Standard; Pin Count: 2; Case: 0402; Mounted: Yes; Socket: No; SMD: Yes; Sense: No; ComponentHeight: 0.55mm; HelpURL: \\cern.ch\dfs\Applications\Altium\Datasheets\IND0402_TDK_MLJ1005.pdf; Author: CERN DEM BC; CreateDate: 13.07.2020; LatestRevisionDate: 13.07.2020
R23 R24 R26 = R0402_10K_1%_0.0625W_100PPM: as R28 on sheet Connectors; Value: 10k; Part Number: R0402_10K_1%_0.0625W_100PPM; Component Kind: Standard; Component Type: Standard; Pin Count: 2; Status: Not Recommended; Power: 0.0625W; Manufacturer Part Number: R0402_10K_1%_0.0625W_100PPM; Case: 0402; Mounted: Yes; Sense: No; Socket: No; SMD: Yes; Manufacturer1 Example: YAGEO PHYCOMP; Manufacturer1 ComponentHeight: 0.4mm; HelpURL: \\cern.ch\dfs\Applications\Altium\Datasheets\R0402_Phycomp_RC0402.pdf; Author: CERN DEM JLC; CreateDate: 03.12.2007; LatestRevisionDate: 17.10.2012
R25 = R0402_100R_1%_0.0625W_100PPM: Resistor - 1%; Part Description: General Purpose Thick Film Chip Resistor; Manufacturer: GENERIC; Manufacturer1 Part Number: 232270671001L; TC: ±100ppm/°C; PressFit: No; Value: 100; Part Number: R0402_100R_1%_0.0625W_100PPM; Component Kind: Standard; Component Type: Standard; Pin Count: 2; Status: Not Recommended; Power: 0.0625W; Manufacturer Part Number: R0402_100R_1%_0.0625W_100PPM; Case: 0402; Mounted: Yes; Sense: No; Socket: No; SMD: Yes; Manufacturer1 Example: YAGEO PHYCOMP; Manufacturer1 ComponentHeight: 0.4mm; HelpURL: \\cern.ch\dfs\Applications\Altium\Datasheets\R0402_Phycomp_RC0402.pdf; Author: CERN DEM JLC; CreateDate: 03.12.2007; LatestRevisionDate: 17.10.2012
R27 R52 R57 R58 = R0402_0R_JUMPER: as R17 on sheet DIGITAL; Part Number: R0402_0R_JUMPER; Component Kind: Standard; Component Type: Standard; Pin Count: 2; Value: 0; Status: Not Recommended; Manufacturer Part Number: R0402_0R_JUMPER; Case: 0402; Mounted: Yes; Sense: No; Socket: No; SMD: Yes; Manufacturer1 Example: YAGEO PHYCOMP; Manufacturer1 ComponentHeight: 0.4mm; HelpURL: \\cern.ch\dfs\Applications\Altium\Datasheets\R0402_Phycomp_RC0402.pdf; Author: CERN DEM JLC; CreateDate: 03.12.2007; LatestRevisionDate: 17.10.2012
R53 = R0603_0R1_1%_0.1W_200PPM: Resistor - 1%; Part Description: Low Value Chip Resistor; Manufacturer: GENERIC; Manufacturer1 Part Number: CRL0603-FW-R100ELF; Power: 0.1W; TC: ±200ppm/°C; PressFit: No; Part Number: R0603_0R1_1%_0.1W_200PPM; Component Kind: Standard; Component Type: Standard; Pin Count: 2; Value: 0R1; Status: Preferred; Manufacturer Part Number: R0603_0R1_1%_0.1W_200PPM; Case: 0603; Mounted: Yes; Sense: No; Socket: No; SMD: Yes; Manufacturer1 Example: BOURNS; Manufacturer1 ComponentHeight: 0.55mm; HelpURL: \\cern.ch\dfs\Applications\Altium\Datasheets\R0603_BOURNS_CRL.pdf; Author: CERN DEM JMW; CreateDate: 26.11.2019; LatestRevisionDate: 26.11.2019
R54 = R0603_1K33_0.1%_0.063W_10PPM: Resistor - 0.1%; Part Description: Thin Film Chip Resistor; Manufacturer: GENERIC; Manufacturer1 Part Number: RN73C1J1K33BTDF; Power: 0.063W; TC: ±10ppm; PressFit: No; Part Number: R0603_1K33_0.1%_0.063W_10PPM; Component Kind: Standard; Component Type: Standard; Pin Count: 2; Value: 1k33; Status: Not Recommended; Manufacturer Part Number: R0603_1K33_0.1%_0.063W_10PPM; Case: 0603; Mounted: Yes; Sense: No; Socket: No; SMD: Yes; Manufacturer1 Example: TYCO HOLSWORTHY; Manufacturer1 ComponentHeight: 0.5mm; HelpURL: \\cern.ch\dfs\Applications\Altium\Datasheets\R0603_Tyco_RN73.pdf; Author: CERN DEM JLC; CreateDate: 03.12.2007; LatestRevisionDate: 13.03.2008
R55 = R0402_1K_1%_0.0625W_100PPM: as R34 on sheet Connectors; Value: 1k; Part Number: R0402_1K_1%_0.0625W_100PPM; Component Kind: Standard; Component Type: Standard; Pin Count: 2; Status: Not Recommended; Power: 0.0625W; Manufacturer Part Number: R0402_1K_1%_0.0625W_100PPM; Case: 0402; Mounted: Yes; Sense: No; Socket: No; SMD: Yes; Manufacturer1 Example: YAGEO PHYCOMP; Manufacturer1 ComponentHeight: 0.4mm; HelpURL: \\cern.ch\dfs\Applications\Altium\Datasheets\R0402_Phycomp_RC0402.pdf; Author: CERN DEM JLC; CreateDate: 03.12.2007; LatestRevisionDate: 17.10.2012
R56 R59-R62 = R0402_33R_1%_0.0625W_100PPM: Resistor - 1%; Part Description: General Purpose Thick Film Chip Resistor; Manufacturer: GENERIC; Manufacturer1 Part Number: 232270673309L; TC: ±100ppm/°C; PressFit: No; Part Number: R0402_33R_1%_0.0625W_100PPM; Component Kind: Standard; Component Type: Standard; Pin Count: 2; Value: 33; Status: Not Recommended; Power: 0.0625W; Manufacturer Part Number: R0402_33R_1%_0.0625W_100PPM; Case: 0402; Mounted: Yes; Sense: No; Socket: No; SMD: Yes; Manufacturer1 Example: YAGEO PHYCOMP; Manufacturer1 ComponentHeight: 0.4mm; HelpURL: \\cern.ch\dfs\Applications\Altium\Datasheets\R0402_Phycomp_RC0402.pdf; Author: CERN DEM JLC; CreateDate: 03.12.2007; LatestRevisionDate: 17.10.2012
U1 = CCNV1_C1: Układ scalony